# EAGLE schematic sensorboard (EAGLE 6.4)
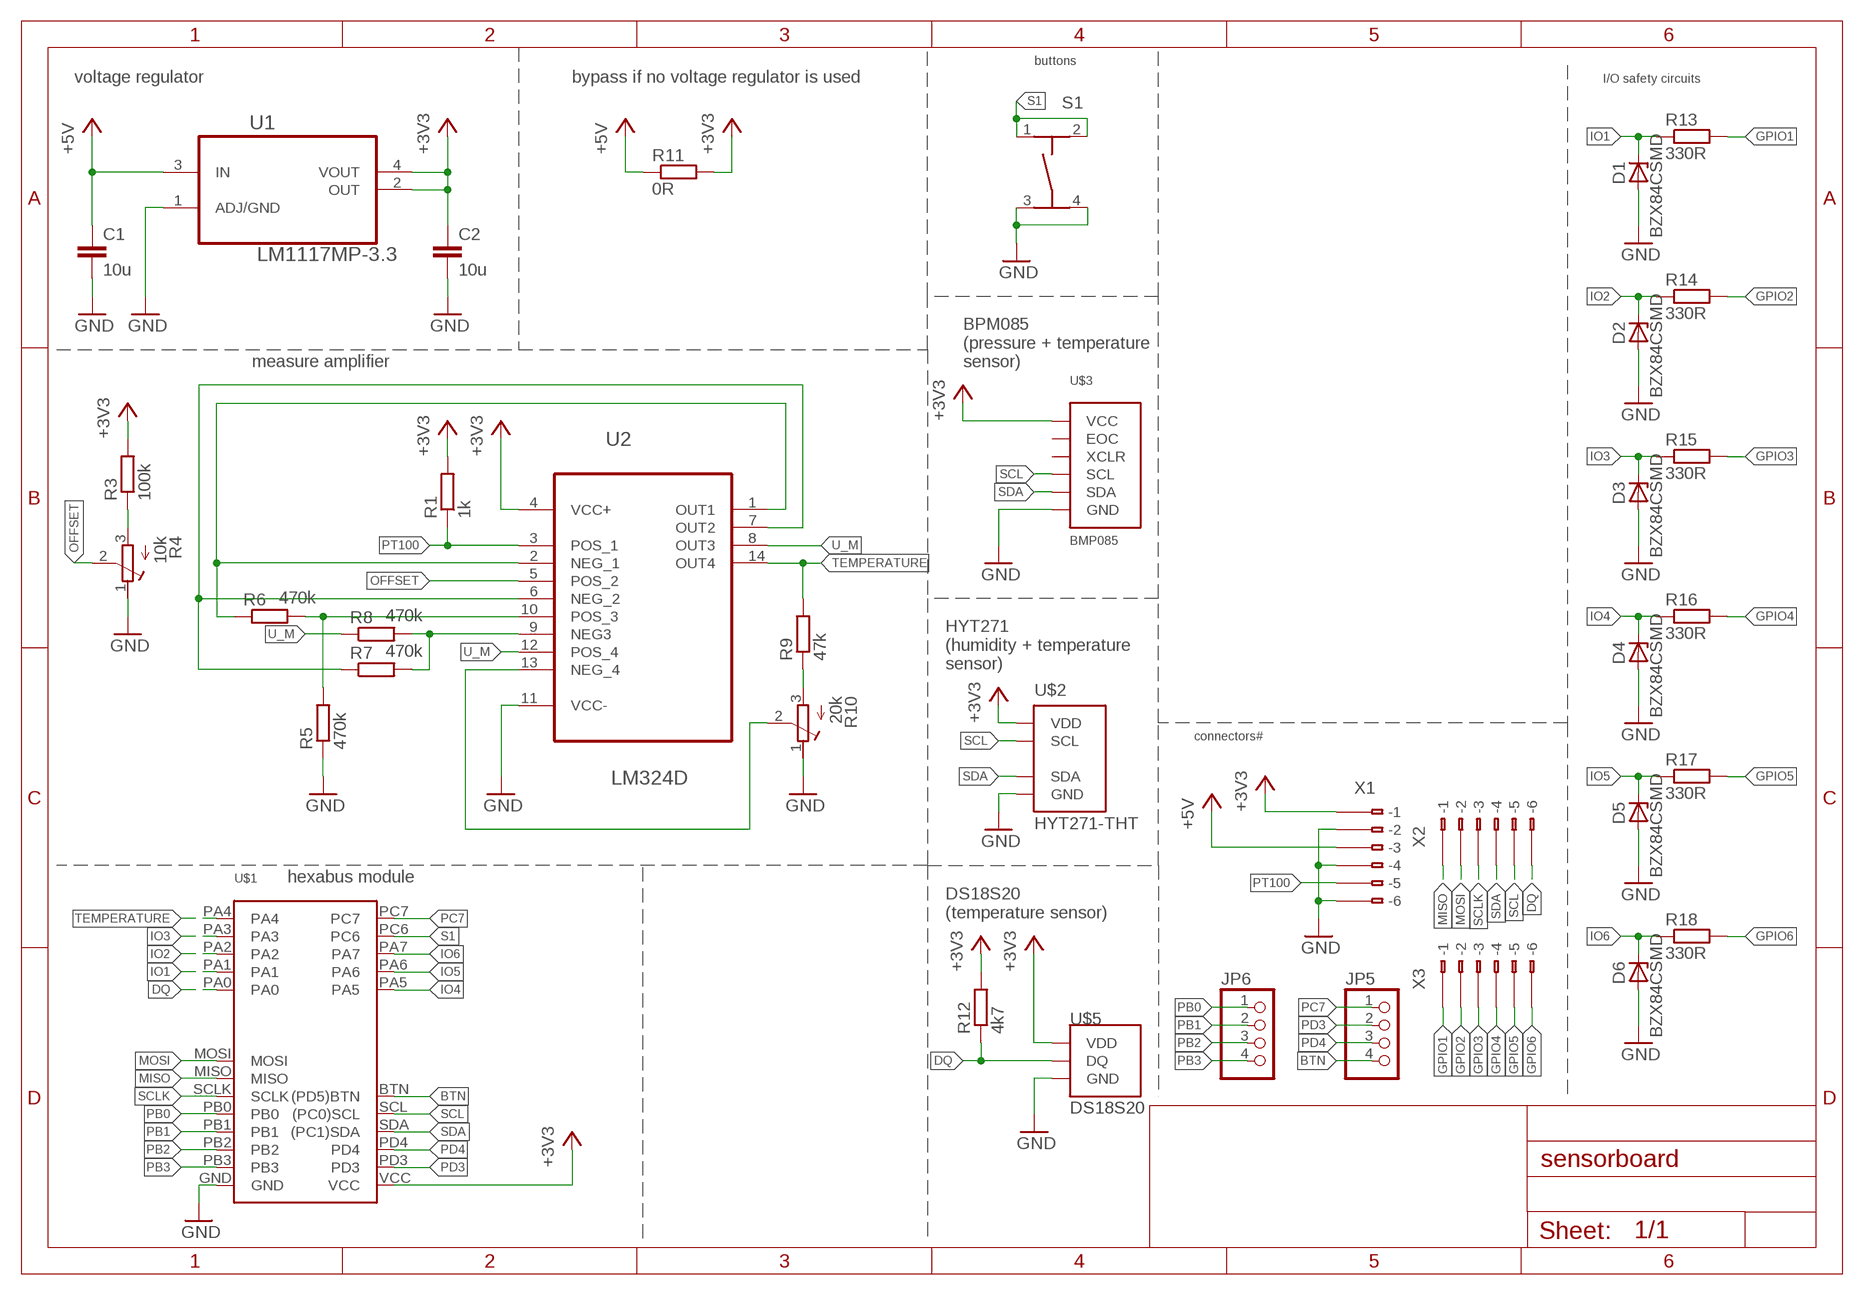
[diagram p0: schematic, sheet 1]

## Parts
C1  10u  C-EUC0805  [C0805]
C2  10u  C-EUC0805  [C0805]
D1  BZX84CSMD  [TO236]
D2  BZX84CSMD  [TO236]
D3  BZX84CSMD  [TO236]
D4  BZX84CSMD  [TO236]
D5  BZX84CSMD  [TO236]
D6  BZX84CSMD  [TO236]
JP5  PINHD-1X4  [1X04]
JP6  PINHD-1X4  [1X04]
R1  1k  R-EU_R0805  [R0805]
R3  100k  R-EU_R0805  [R0805]
R4  10k  R-TRIMMT93YB  [RTRIMT93YB]
R5  470k  R-EU_R0805  [R0805]
R6  470k  R-EU_R0805  [R0805]
R7  470k  R-EU_R0805  [R0805]
R8  470k  R-EU_R0805  [R0805]
R9  47k  R-EU_R0805  [R0805]
R10  20k  R-TRIMMT93YB  [RTRIMT93YB]
R11  0R  R-EU_R0805  [R0805]
R12  4k7  R-EU_R0805  [R0805]
R13  330R  R-EU_R0805  [R0805]
R14  330R  R-EU_R0805  [R0805]
R15  330R  R-EU_R0805  [R0805]
R16  330R  R-EU_R0805  [R0805]
R17  330R  R-EU_R0805  [R0805]
R18  330R  R-EU_R0805  [R0805]
S1  TASTER-9314_SMD  [TASTER-9314_SMD]
U1  LM1117MP-3.3  [SOT230P696X180-4N]
U2  LM324D  [SOIC127P600X175-14N]
U$1  HEXABUS  [HEXABUS]
U$2  HYT271-THT  [HYT271-THT]
U$3  BMP085  [BREAKOUT]
U$5  DS18S20  [TO-92]
X1  233-206  [233-206]
X2  233-206  [233-206]
X3  233-206  [233-206]

## Nets
+3V3: C2.1 R1.2 R3.2 R11.2 R12.2 U1.2(OUT) U1.4(VOUT) U2.4(VCC+) U$1.VCC U$2.VDD U$3.VCC U$5.VDD X1.B1(B-1)
+5V: C1.1 R11.1 U1.3(IN) X1.B3(B-3)
BTN: JP5.4 U$1.BTN((PD5)BTN)
DQ: R12.1 U$1.PA0 U$5.DQ X2.B6(B-6)
GND: C1.2 C2.2 D1.A D2.A D3.A D4.A D5.A D6.A R4.1(E) R5.1 R10.1(E) S1.3 S1.4 U1.1(ADJ/GND) U2.11(VCC-) U$1.GND U$2.GND U$3.GND U$5.GND X1.B2(B-2) X1.B4(B-4) X1.B6(B-6)
GPIO1: R13.2 X3.B1(B-1)
GPIO2: R14.2 X3.B2(B-2)
GPIO3: R15.2 X3.B3(B-3)
GPIO4: R16.2 X3.B4(B-4)
GPIO5: R17.2 X3.B5(B-5)
GPIO6: R18.2 X3.B6(B-6)
IO1: D1.C R13.1 U$1.PA1
IO2: D2.C R14.1 U$1.PA2
IO3: D3.C R15.1 U$1.PA3
IO4: D4.C R16.1 U$1.PA5
IO5: D5.C R17.1 U$1.PA6
IO6: D6.C R18.1 U$1.PA7
MISO: U$1.MISO X2.B1(B-1)
MOSI: U$1.MOSI X2.B2(B-2)
N$1: R6.1 U2.1(OUT1) U2.2(NEG_1)
N$2: R7.1 U2.6(NEG_2) U2.7(OUT2)
N$3: R5.2 R6.2 U2.10(POS_3)
N$4: R7.2 R8.2 U2.9(NEG3)
N$5: R10.2(S) U2.13(NEG_4)
N$6: R9.1 R10.3(A)
N$7: R3.1 R4.3(A)
OFFSET: R4.2(S) U2.5(POS_2)
PB0: JP6.1 U$1.PB0
PB1: JP6.2 U$1.PB1
PB2: JP6.3 U$1.PB2
PB3: JP6.4 U$1.PB3
PC7: JP5.1 U$1.PC7
PD3: JP5.2 U$1.PD3
PD4: JP5.3 U$1.PD4
PT100: R1.1 U2.3(POS_1) X1.B5(B-5)
S1: S1.1 S1.2 U$1.PC6
SCL: U$1.SCL((PC0)SCL) U$2.SCL U$3.SCL X2.B5(B-5)
SCLK: U$1.SCLK X2.B3(B-3)
SDA: U$1.SDA((PC1)SDA) U$2.SDA U$3.SDA X2.B4(B-4)
TEMPERATURE: R9.2 U2.14(OUT4) U$1.PA4
U_M: R8.1 U2.8(OUT3) U2.12(POS_4)
Unconnected: U$3.EOC U$3.XCLR X1.A1(-1) X1.A2(-2) X1.A3(-3) X1.A4(-4) X1.A5(-5) X1.A6(-6) X2.A1(-1) X2.A2(-2) X2.A3(-3) X2.A4(-4) X2.A5(-5) X2.A6(-6) X3.A1(-1) X3.A2(-2) X3.A3(-3) X3.A4(-4) X3.A5(-5) X3.A6(-6)

## Notes on the sheet
- buttons
- voltage regulator | bypass if no voltage regulator is used | I/O safety circuits
- measure amplifier
- BPM085
  (pressure + temperature
  sensor)
- HYT271
  (humidity + temperature
  sensor)
- connectors#
- hexabus module
- DS18S20
  (temperature sensor)

## Library data of the parts
C1 C2 = rcl:C-EU: CAPACITOR, European symbol
D1-D6 = diode:BZX84CSMD: Z DIODE
JP5 JP6 = pinhead:PINHD-1X4: PIN HEADER
R1 R3 R5-R9 R11-R18 = rcl:R-EU_: RESISTOR, European symbol
R4 R10 = rcl:R-TRIMM: Trimm resistor
S1 = Ergaenzung:TASTER-9314_SMD
U1 = hexasense:LM1117MP-3.3: Linear regulators; MPN: LM1117MP-3.3; OC_FARNELL: 9778195; OC_NEWARK: 41K3470; PACKAGE: SOT223-3; SUPPLIER: NationalSemiconductor
U2 = hexasense:LM324D: Low power quad operational amplifiers; MPN: LM324D; OC_FARNELL: 1467655; OC_NEWARK: 72K8847; PACKAGE: SOIC-14; SUPPLIER: STMicroelectronics
U$1 = hexabus:HEXABUS
U$2 = humidity:HYT271-THT
U$3 = humidity:BMP085
U$5 = dallas:DS18S20
X1-X3 = con-wago:233-206: WAGO Cage Clamp; MPN: 233-206; OC_FARNELL: 1283536; OC_NEWARK: 28K9063